# EAGLE design espseq (EAGLE 9.6.2)
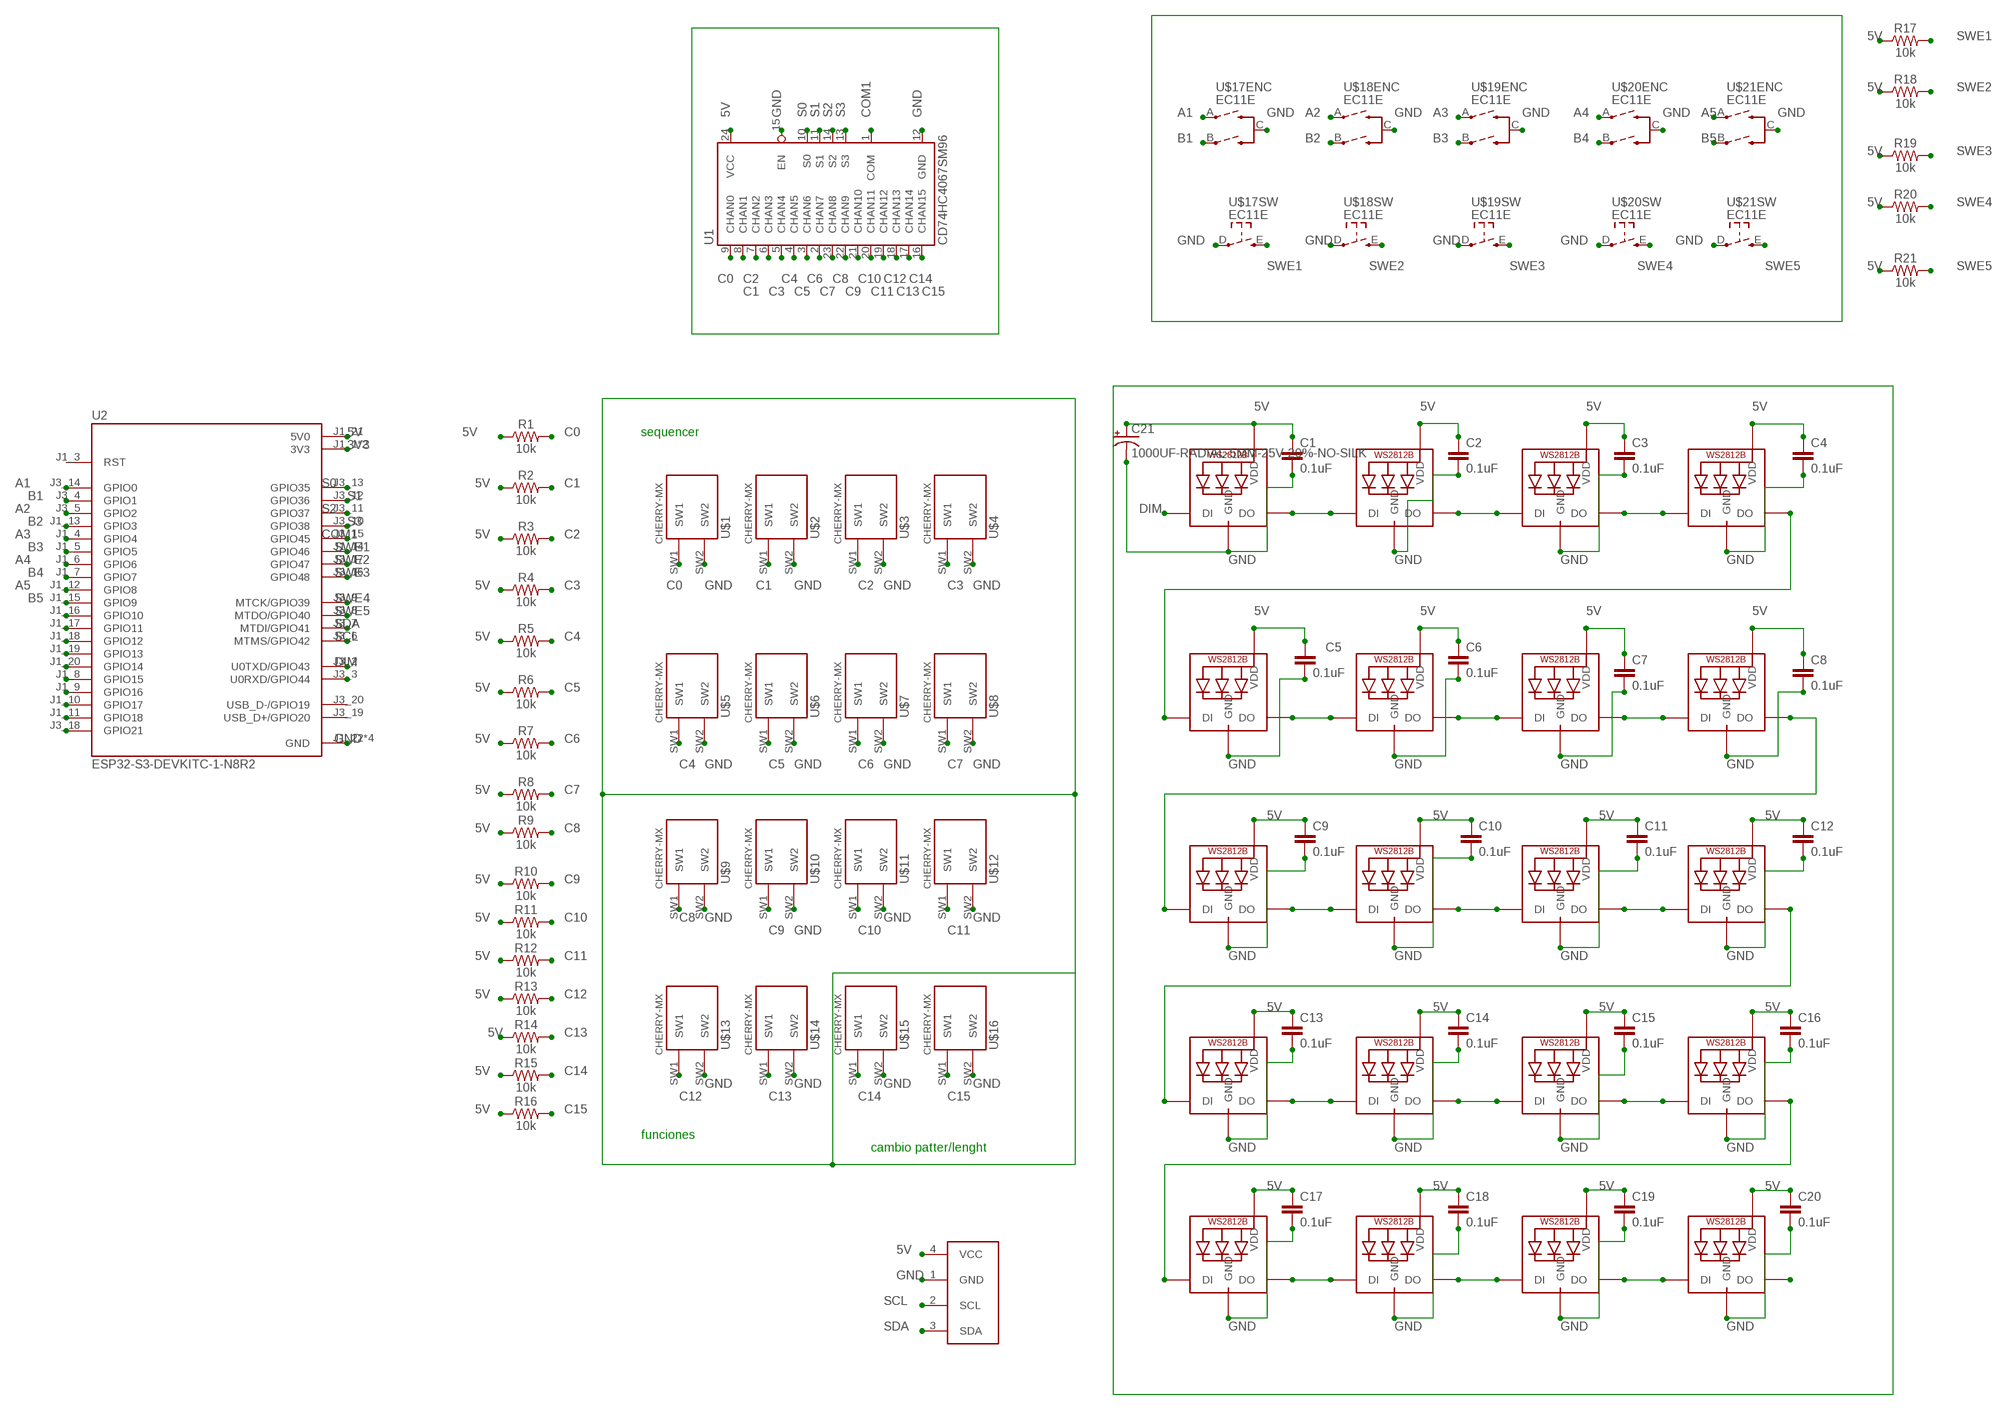
[diagram p0: schematic, sheet 1]

## Parts
C1  0.1uF  0.1UF-0402-6.3V-10%-X7R  [0402]
C2  0.1uF  0.1UF-0402-6.3V-10%-X7R  [0402]
C3  0.1uF  0.1UF-0402-6.3V-10%-X7R  [0402]
C4  0.1uF  0.1UF-0402-6.3V-10%-X7R  [0402]
C5  0.1uF  0.1UF-0402-6.3V-10%-X7R  [0402]
C6  0.1uF  0.1UF-0402-6.3V-10%-X7R  [0402]
C7  0.1uF  0.1UF-0402-6.3V-10%-X7R  [0402]
C8  0.1uF  0.1UF-0402-6.3V-10%-X7R  [0402]
C9  0.1uF  0.1UF-0402-6.3V-10%-X7R  [0402]
C10  0.1uF  0.1UF-0402-6.3V-10%-X7R  [0402]
C11  0.1uF  0.1UF-0402-6.3V-10%-X7R  [0402]
C12  0.1uF  0.1UF-0402-6.3V-10%-X7R  [0402]
C13  0.1uF  0.1UF-0402-6.3V-10%-X7R  [0402]
C14  0.1uF  0.1UF-0402-6.3V-10%-X7R  [0402]
C15  0.1uF  0.1UF-0402-6.3V-10%-X7R  [0402]
C16  0.1uF  0.1UF-0402-6.3V-10%-X7R  [0402]
C17  0.1uF  0.1UF-0402-6.3V-10%-X7R  [0402]
C18  0.1uF  0.1UF-0402-6.3V-10%-X7R  [0402]
C19  0.1uF  0.1UF-0402-6.3V-10%-X7R  [0402]
C20  0.1uF  0.1UF-0402-6.3V-10%-X7R  [0402]
C21  1000UF-RADIAL-5MM-25V-20%-NO-SILK  [CPOL-RADIAL-5MM-10MM-NS]
LED1  WS2812B5050  [WS2812B]
LED2  WS2812B5050  [WS2812B]
LED3  WS2812B5050  [WS2812B]
LED4  WS2812B5050  [WS2812B]
LED5  WS2812B5050  [WS2812B]
LED6  WS2812B5050  [WS2812B]
LED7  WS2812B5050  [WS2812B]
LED8  WS2812B5050  [WS2812B]
LED9  WS2812B5050  [WS2812B]
LED10  WS2812B5050  [WS2812B]
LED11  WS2812B5050  [WS2812B]
LED12  WS2812B5050  [WS2812B]
LED13  WS2812B5050  [WS2812B]
LED14  WS2812B5050  [WS2812B]
LED15  WS2812B5050  [WS2812B]
LED16  WS2812B5050  [WS2812B]
LED17  WS2812B5050  [WS2812B]
LED18  WS2812B5050  [WS2812B]
LED19  WS2812B5050  [WS2812B]
LED20  WS2812B5050  [WS2812B]
R1  10k  10KOHM-0402T-1/16W-1%  [0402-TIGHT]
R2  10k  10KOHM-0402T-1/16W-1%  [0402-TIGHT]
R3  10k  10KOHM-0402T-1/16W-1%  [0402-TIGHT]
R4  10k  10KOHM-0402T-1/16W-1%  [0402-TIGHT]
R5  10k  10KOHM-0402T-1/16W-1%  [0402-TIGHT]
R6  10k  10KOHM-0402T-1/16W-1%  [0402-TIGHT]
R7  10k  10KOHM-0402T-1/16W-1%  [0402-TIGHT]
R8  10k  10KOHM-0402T-1/16W-1%  [0402-TIGHT]
R9  10k  10KOHM-0402T-1/16W-1%  [0402-TIGHT]
R10  10k  10KOHM-0402T-1/16W-1%  [0402-TIGHT]
R11  10k  10KOHM-0402T-1/16W-1%  [0402-TIGHT]
R12  10k  10KOHM-0402T-1/16W-1%  [0402-TIGHT]
R13  10k  10KOHM-0402T-1/16W-1%  [0402-TIGHT]
R14  10k  10KOHM-0402T-1/16W-1%  [0402-TIGHT]
R15  10k  10KOHM-0402T-1/16W-1%  [0402-TIGHT]
R16  10k  10KOHM-0402T-1/16W-1%  [0402-TIGHT]
R17  10k  10KOHM-0402T-1/16W-1%  [0402-TIGHT]
R18  10k  10KOHM-0402T-1/16W-1%  [0402-TIGHT]
R19  10k  10KOHM-0402T-1/16W-1%  [0402-TIGHT]
R20  10k  10KOHM-0402T-1/16W-1%  [0402-TIGHT]
R21  10k  10KOHM-0402T-1/16W-1%  [0402-TIGHT]
U1  CD74HC4067SM96  74HC4067SM96  [SSOP24]
U2  ESP32-S3-DEVKITC-1-N8R2  [XCVR_ESP32-S3-DEVKITC-1-N8R2]
U$1  CHERRY-MXSTANDARD  [CHERRY-MX]
U$2  CHERRY-MXSTANDARD  [CHERRY-MX]
U$3  CHERRY-MXSTANDARD  [CHERRY-MX]
U$4  CHERRY-MXSTANDARD  [CHERRY-MX]
U$5  CHERRY-MXSTANDARD  [CHERRY-MX]
U$6  CHERRY-MXSTANDARD  [CHERRY-MX]
U$7  CHERRY-MXSTANDARD  [CHERRY-MX]
U$8  CHERRY-MXSTANDARD  [CHERRY-MX]
U$9  CHERRY-MXSTANDARD  [CHERRY-MX]
U$10  CHERRY-MXSTANDARD  [CHERRY-MX]
U$11  CHERRY-MXSTANDARD  [CHERRY-MX]
U$12  CHERRY-MXSTANDARD  [CHERRY-MX]
U$13  CHERRY-MXSTANDARD  [CHERRY-MX]
U$14  CHERRY-MXSTANDARD  [CHERRY-MX]
U$15  CHERRY-MXSTANDARD  [CHERRY-MX]
U$16  CHERRY-MXSTANDARD  [CHERRY-MX]
U$17  EC11E  [EC11E]
U$18  EC11E  [EC11E]
U$19  EC11E  [EC11E]
U$20  EC11E  [EC11E]
U$21  EC11E  [EC11E]
U$22  I2C_OLED  [I2C_OLED_PACKAGE]

## Nets
3V3: U2.J1_1(3V3) U2.J1_2(3V3)
5V: C1.1 C2.1 C3.1 C4.1 C5.1 C6.1 C7.1 C8.1 C9.1 C10.1 C11.1 C12.1 C13.1 C14.1 C15.1 C16.1 C17.1 C18.1 C19.1 C20.1 C21.+ LED1.1-VDD(VDD) LED2.1-VDD(VDD) LED3.1-VDD(VDD) LED4.1-VDD(VDD) LED5.1-VDD(VDD) LED6.1-VDD(VDD) LED7.1-VDD(VDD) LED8.1-VDD(VDD) LED9.1-VDD(VDD) LED10.1-VDD(VDD) LED11.1-VDD(VDD) LED12.1-VDD(VDD) LED13.1-VDD(VDD) LED14.1-VDD(VDD) LED15.1-VDD(VDD) LED16.1-VDD(VDD) LED17.1-VDD(VDD) LED18.1-VDD(VDD) LED19.1-VDD(VDD) LED20.1-VDD(VDD) R1.1 R2.1 R3.1 R4.1 R5.1 R6.1 R7.1 R8.1 R9.1 R10.1 R11.1 R12.1 R13.1 R14.1 R15.1 R16.1 R17.1 R18.1 R19.1 R20.1 R21.1 U1.24(VCC) U2.J1_21(5V0) U$22.4(VCC)
A1: U2.J3_14(GPIO0) U$17.A(ENC:A)
A2: U2.J3_5(GPIO2) U$18.A(ENC:A)
A3: U2.J1_4(GPIO4) U$19.A(ENC:A)
A4: U2.J1_6(GPIO6) U$20.A(ENC:A)
A5: U2.J1_12(GPIO8) U$21.A(ENC:A)
B1: U2.J3_4(GPIO1) U$17.B(ENC:B)
B2: U2.J1_13(GPIO3) U$18.B(ENC:B)
B3: U2.J1_5(GPIO5) U$19.B(ENC:B)
B4: U2.J1_7(GPIO7) U$20.B(ENC:B)
B5: U2.J1_15(GPIO9) U$21.B(ENC:B)
C0: R1.2 U1.9(CHAN0) U$1.SW1
C1: R2.2 U1.8(CHAN1) U$2.SW1
C2: R3.2 U1.7(CHAN2) U$3.SW1
C3: R4.2 U1.6(CHAN3) U$4.SW1
C4: R5.2 U1.5(CHAN4) U$5.SW1
C5: R6.2 U1.4(CHAN5) U$6.SW1
C6: R7.2 U1.3(CHAN6) U$7.SW1
C7: R8.2 U1.2(CHAN7) U$8.SW1
C8: R9.2 U1.23(CHAN8) U$9.SW1
C9: R10.2 U1.22(CHAN9) U$10.SW1
C10: R11.2 U1.21(CHAN10) U$11.SW1
C11: R12.2 U1.20(CHAN11) U$12.SW1
C12: R13.2 U1.19(CHAN12) U$13.SW1
C13: R14.2 U1.18(CHAN13) U$14.SW1
C14: R15.2 U1.17(CHAN14) U$15.SW1
C15: R16.2 U1.16(CHAN15) U$16.SW1
COM1: U1.1(COM) U2.J3_15(GPIO45)
DIM: LED1.4-DIN(DI) U2.J3_2(U0TXD/GPIO43)
GND: C1.2 C2.2 C3.2 C4.2 C5.2 C6.2 C7.2 C8.2 C9.2 C10.2 C11.2 C12.2 C13.2 C14.2 C15.2 C16.2 C17.2 C18.2 C19.2 C20.2 C21.- LED1.3-GND(GND) LED2.3-GND(GND) LED3.3-GND(GND) LED4.3-GND(GND) LED5.3-GND(GND) LED6.3-GND(GND) LED7.3-GND(GND) LED8.3-GND(GND) LED9.3-GND(GND) LED10.3-GND(GND) LED11.3-GND(GND) LED12.3-GND(GND) LED13.3-GND(GND) LED14.3-GND(GND) LED15.3-GND(GND) LED16.3-GND(GND) LED17.3-GND(GND) LED18.3-GND(GND) LED19.3-GND(GND) LED20.3-GND(GND) U1.12(GND) U1.15(EN) U2.J1_22(GND) U2.J3_1(GND) U2.J3_21(GND) U2.J3_22(GND) U$1.SW2 U$2.SW2 U$3.SW2 U$4.SW2 U$5.SW2 U$6.SW2 U$7.SW2 U$8.SW2 U$9.SW2 U$10.SW2 U$11.SW2 U$12.SW2 U$13.SW2 U$14.SW2 U$15.SW2 U$16.SW2 U$17.C(ENC:C) U$17.D U$18.C(ENC:C) U$18.D U$19.C(ENC:C) U$19.D U$20.C(ENC:C) U$20.D U$21.C(ENC:C) U$21.D U$22.1(GND)
N$3: LED1.2-DOUT(DO) LED2.4-DIN(DI)
N$7: LED2.2-DOUT(DO) LED3.4-DIN(DI)
N$11: LED3.2-DOUT(DO) LED4.4-DIN(DI)
N$16: LED4.2-DOUT(DO) LED5.4-DIN(DI)
N$19: LED5.2-DOUT(DO) LED6.4-DIN(DI)
N$21: U2.J1_16(GPIO10)
N$22: U2.J1_17(GPIO11)
N$23: LED6.2-DOUT(DO) LED7.4-DIN(DI)
N$24: U2.J1_18(GPIO12)
N$25: U2.J1_19(GPIO13)
N$26: U2.J1_20(GPIO14)
N$27: LED7.2-DOUT(DO) LED8.4-DIN(DI)
N$28: U2.J1_8(GPIO15)
N$29: U2.J1_9(GPIO16)
N$30: U2.J1_10(GPIO17)
N$31: U2.J1_11(GPIO18)
N$32: LED8.2-DOUT(DO) LED9.4-DIN(DI)
N$33: U2.J3_18(GPIO21)
N$35: LED9.2-DOUT(DO) LED10.4-DIN(DI)
N$39: LED10.2-DOUT(DO) LED11.4-DIN(DI)
N$43: LED11.2-DOUT(DO) LED12.4-DIN(DI)
N$48: LED12.2-DOUT(DO) LED13.4-DIN(DI)
N$51: LED13.2-DOUT(DO) LED14.4-DIN(DI)
N$52: U2.J3_3(U0RXD/GPIO44)
N$55: LED14.2-DOUT(DO) LED15.4-DIN(DI)
N$59: LED15.2-DOUT(DO) LED16.4-DIN(DI)
N$64: LED16.2-DOUT(DO) LED17.4-DIN(DI)
N$67: LED17.2-DOUT(DO) LED18.4-DIN(DI)
N$71: LED18.2-DOUT(DO) LED19.4-DIN(DI)
N$75: LED19.2-DOUT(DO) LED20.4-DIN(DI)
N$80: LED20.2-DOUT(DO)
S0: U1.10(S0) U2.J3_13(GPIO35)
S1: U1.11(S1) U2.J3_12(GPIO36)
S2: U1.14(S2) U2.J3_11(GPIO37)
S3: U1.13(S3) U2.J3_10(GPIO38)
SCL: U2.J3_6(MTMS/GPIO42) U$22.2(SCL)
SDA: U2.J3_7(MTDI/GPIO41) U$22.3(SDA)
SWE1: R17.2 U2.J1_14(GPIO46) U$17.E
SWE2: R18.2 U2.J3_17(GPIO47) U$18.E
SWE3: R19.2 U2.J3_16(GPIO48) U$19.E
SWE4: R20.2 U2.J3_9(MTCK/GPIO39) U$20.E
SWE5: R21.2 U2.J3_8(MTDO/GPIO40) U$21.E
Unconnected: U2.J1_3(RST) U2.J3_19(USB_D+/GPIO20) U2.J3_20(USB_D-/GPIO19)

## Notes on the sheet
- sequencer
- funciones
- cambio patter/lenght

## Library data of the parts
C1-C20 = SparkFun-Capacitors:0.1UF: 0.1µF ceramic capacitors A capacitor is a passive two-terminal electrical component used to store electrical energy temporarily in an electric field.; PROD_ID: CAP-14993
C21 = SparkFun-Capacitors:1000UF: 1,000µF/1mF ceramic capacitors A capacitor is a passive two-terminal electrical component used to store electrical energy temporarily in an electric field. CAP-08070
LED1-LED20 = adafruit:WS2812B
R1-R21 = SparkFun-Resistors:10KOHM: 10kΩ resistor A resistor is a passive two-terminal electrical component that implements electrical resistance as a circuit element. Resistors act to reduce current flow, and, at the same time, act to lower voltage levels within circuits. - Wikipedia; PROD_ID: RES-14241
U1 = SparkFun-IC-Logic:74*4067: 16-channel analog MUX Datasheet <http://www.sparkfun.com/datasheets/IC/cd74hc4067.pdf> SparkFun Products MP3 Trigger <https://www.sparkfun.com/products/13720> (WIG-13720) SparkFun Analog/Digital MUX Breakout - CD74HC4067 <https://www.sparkfun.com/products/9056> (BOB-09056); PROD_ID: IC-08252
U2 = ESP32-S3-DEVKITC-1-N8R2:ESP32-S3-DEVKITC-1-N8R2: Check availability <https://pricing.snapeda.com/parts/ESP32-S3-DEVKITC-1-N8R2/Espressif%20Systems/view-part?ref=eda>; AVAILABILITY: In Stock; CHECK_PRICES: https://www.snapeda.com/parts/ESP32-S3-DEVKITC-1-N8R2/Espressif+Systems/view-part/?ref=eda; DESCRIPTION: WiFi Development Tools - 802.11 ESP32-S3 general-purpose development board, embeds ESP32-S3-WROOM-1-N8R2, with pin header; MF: Espressif Systems; MP: ESP32-S3-DEVKITC-1-N8R2; PACKAGE: None; PRICE: None; SNAPEDA_LINK: https://www.snapeda.com/parts/ESP32-S3-DEVKITC-1-N8R2/Espressif+Systems/view-part/?ref=snap
U$1-U$16 = cherrymx:CHERRY-MX: Cherry MX series keyswitch
U$17-U$21 = logick:EC11
U$22 = DIYMall_OLED:I2C_OLED

## Board
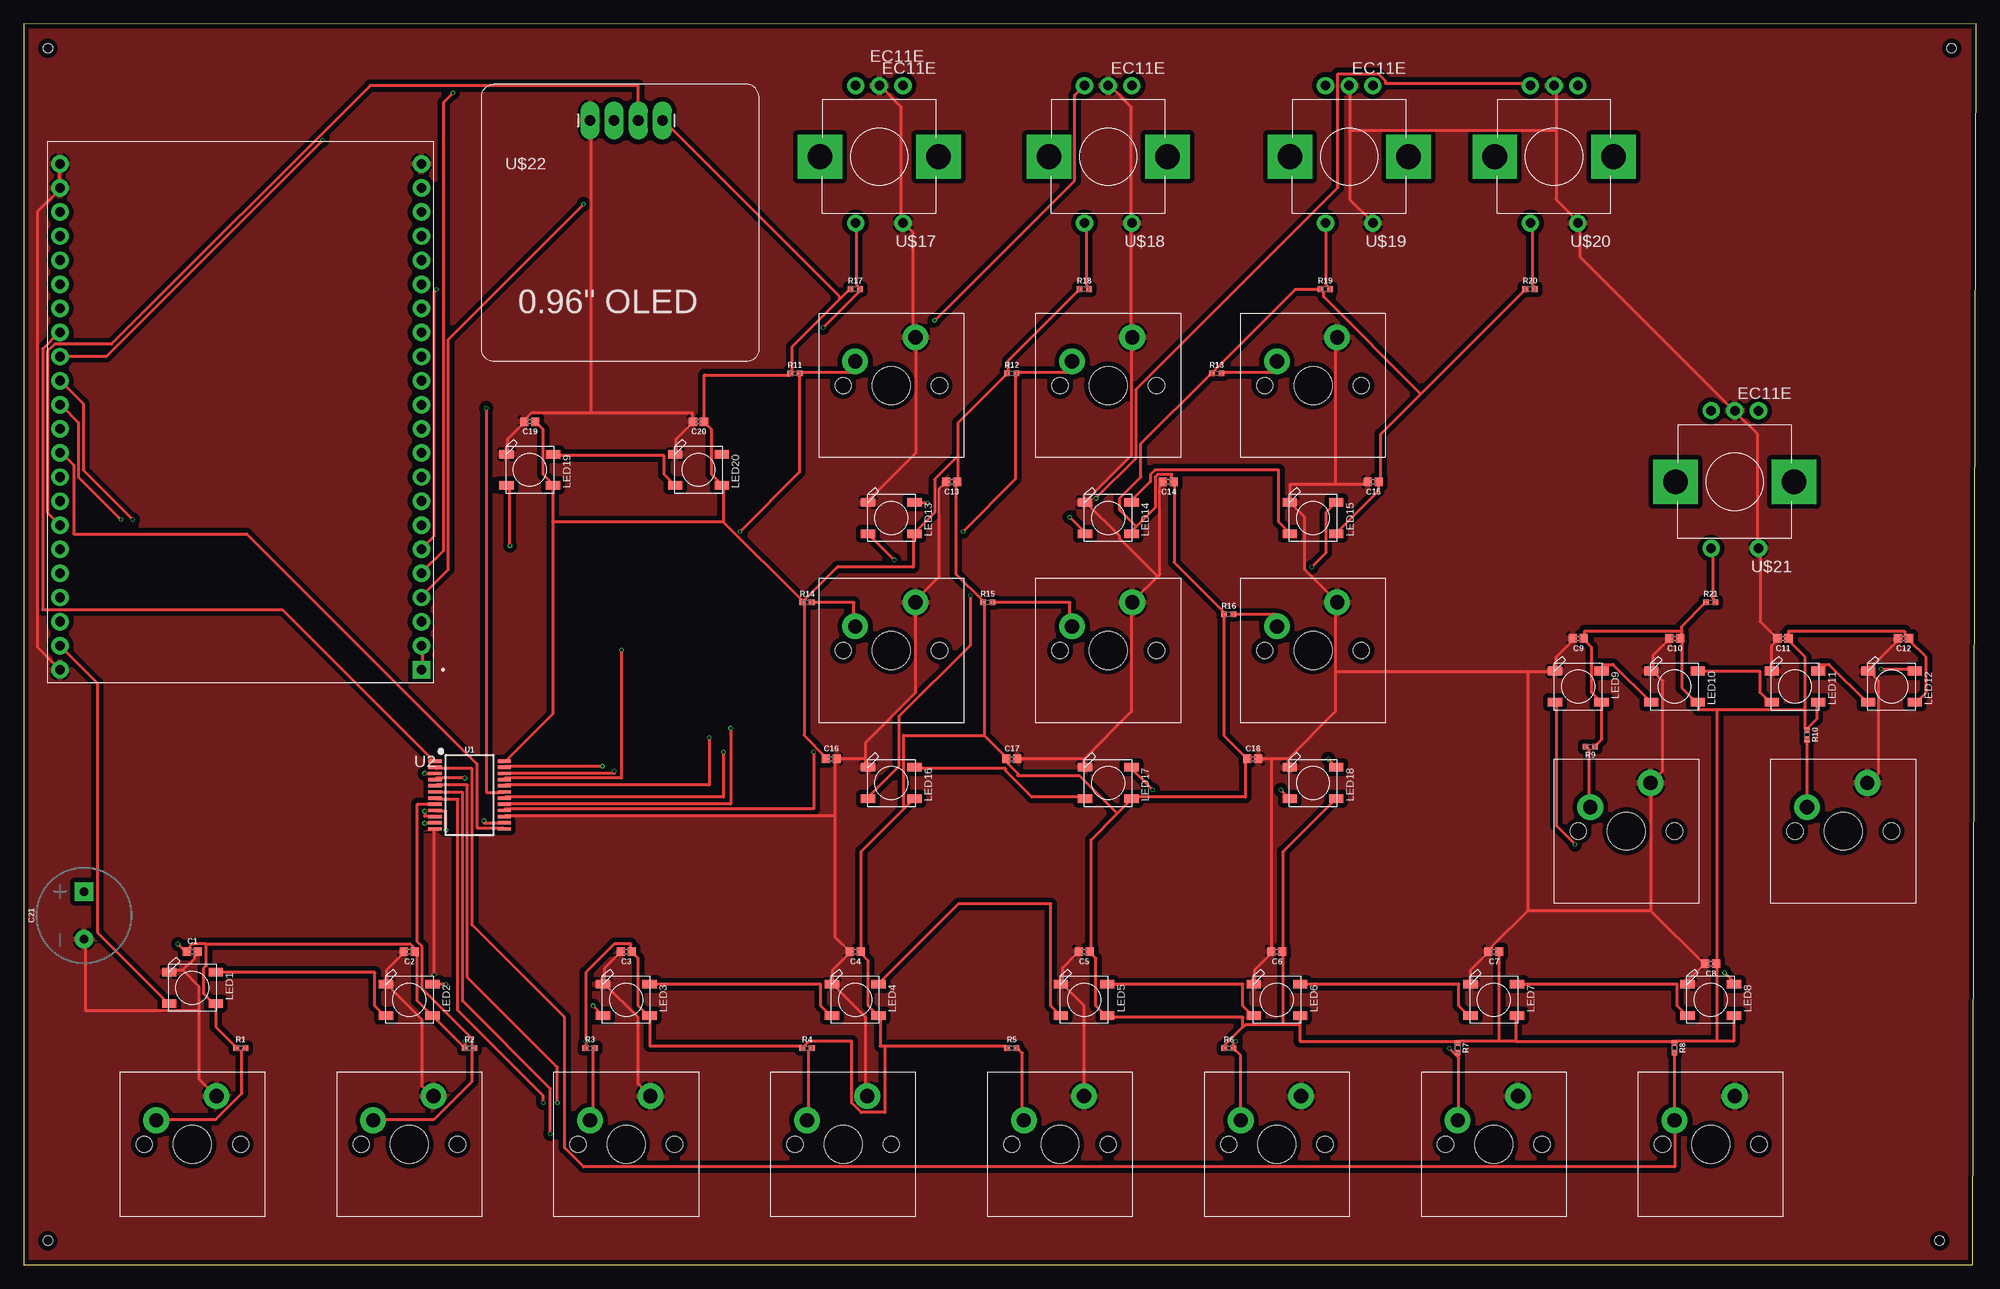
[diagram p1: board, top side]
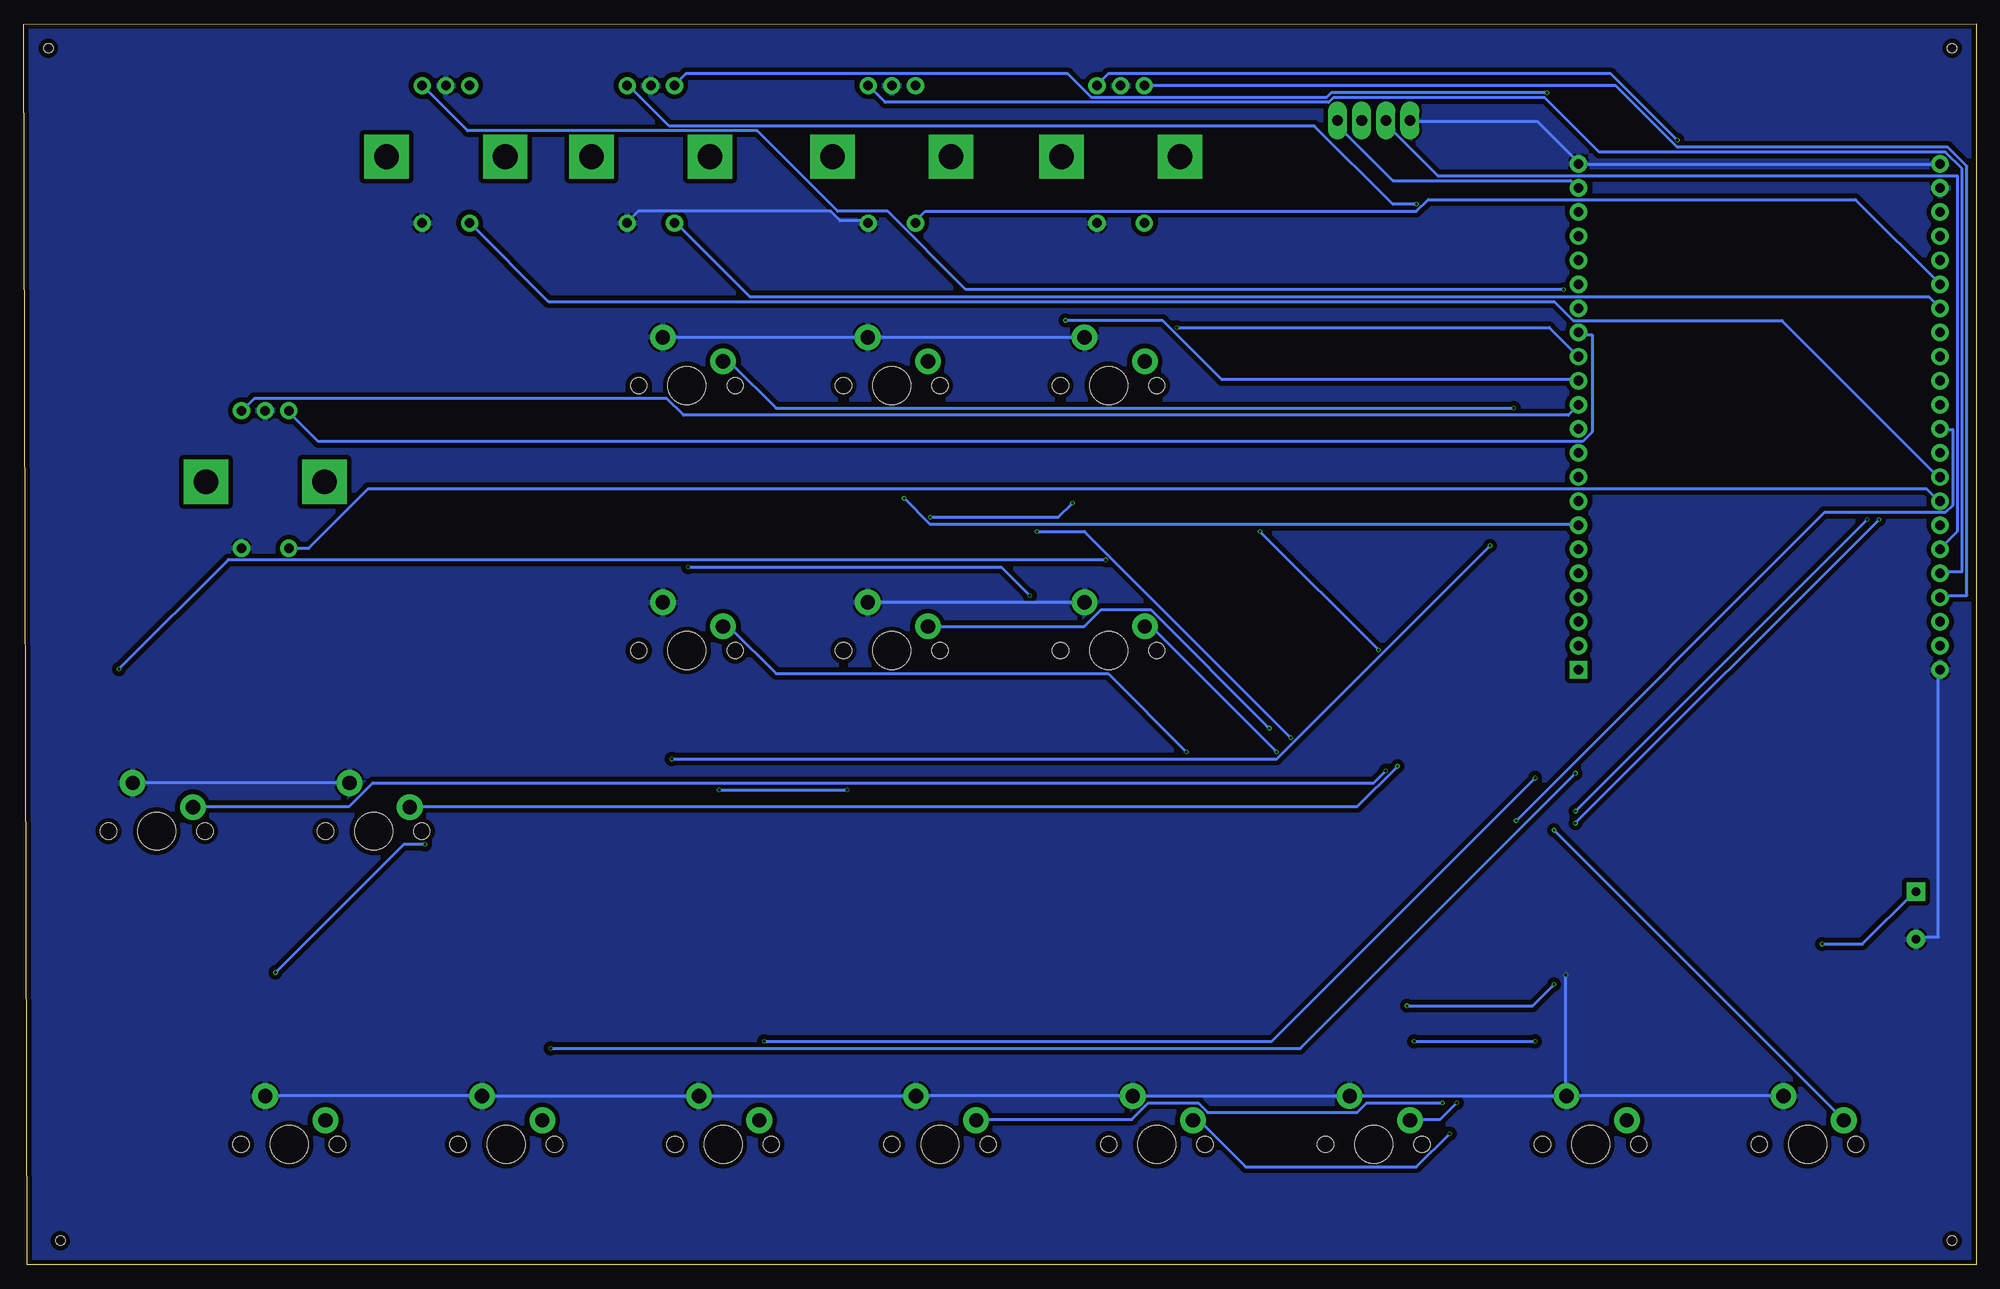
[diagram p2: board, bottom side, seen from below]

Size 205.79 x 130.86 mm. Coordinates in mm from the lower left corner, seen from the top.
Outline: 0,0 205.41,0 205.79,130.8 0,130.86 0,0
Copper layers (1*16): Top 0.035mm / dielectric 1.6mm / Bottom 0.035mm
Design rules "jlcpcb-2layers *": minimum track width 12mil, minimum drill 0.3mm, track to track 5mil, track to pad 5mil, pad to pad 5mil, via to via 5mil, smd to smd 5mil, copper to edge 0.2mm, drill to drill 6mil, minimum pad ring 10mil, minimum via ring 3mil, stop-mask expansion 4mil, vias tented up to drill 0mil, thermal gap 10mil
Holes 1 mm at 2.54,2.54 201.93,2.54 2.54,128.27 203.2,128.27

### Footprints (pad centres in the part's own frame; a part is rotated, then mirrored left to right if it is on the bottom)
0402 = smd 0.85 x 0.9: 1 -0.58,0; 2 0.58,0
CPOL-RADIAL-5MM-10MM-NS = drill 0.9 pad 1.93 square: + 2.5,0 | drill 0.9 pad 1.93: - -2.5,0
WS2812B = smd 1.5 x 0.9: 1-VDD 2.45,-1.65; 2-DOUT 2.45,1.65; 3-GND -2.45,1.65; 4-DIN -2.45,-1.65
0402-TIGHT = smd 0.6 x 0.6: 1 -0.5,0; 2 0.5,0
SSOP24 = smd 0.348 x 1.397: 1 -3.575,-3.656; 2 -2.925,-3.656; 3 -2.275,-3.656; 4 -1.625,-3.656; 5 -0.975,-3.656; 6 -0.325,-3.656; 7 0.325,-3.656; 8 0.975,-3.656; 9 1.625,-3.656; 10 2.275,-3.656; 11 2.925,-3.656; 12 3.575,-3.656; 13 3.575,3.656; 14 2.925,3.656; 15 2.275,3.656; 16 1.625,3.656; 17 0.975,3.656; 18 0.325,3.656; 19 -0.325,3.656; 20 -0.975,3.656; 21 -1.625,3.656; 22 -2.275,3.656; 23 -2.925,3.656; 24 -3.575,3.656
XCVR_ESP32-S3-DEVKITC-1-N8R2 = drill 1.02 square: J1_1 -11.43,29.97 | drill 1.02: J1_2 -11.43,27.43; J1_3 -11.43,24.89; J1_4 -11.43,22.35; J1_5 -11.43,19.81; J1_6 -11.43,17.27; J1_7 -11.43,14.73; J1_8 -11.43,12.19; J1_9 -11.43,9.65; J1_10 -11.43,7.11; J1_11 -11.43,4.57; J1_12 -11.43,2.03; J1_13 -11.43,-0.51; J1_14 -11.43,-3.05; J1_15 -11.43,-5.59; J1_16 -11.43,-8.13; J1_17 -11.43,-10.67; J1_18 -11.43,-13.21; J1_19 -11.43,-15.75; J1_20 -11.43,-18.29; J1_21 -11.43,-20.83; J1_22 -11.43,-23.37; J3_1 26.67,29.97; J3_2 26.67,27.43; J3_3 26.67,24.89; J3_4 26.67,22.35; J3_5 26.67,19.81; J3_6 26.67,17.27; J3_7 26.67,14.73; J3_8 26.67,12.19; J3_9 26.67,9.65; J3_10 26.67,7.11; J3_11 26.67,4.57; J3_12 26.67,2.03; J3_13 26.67,-0.51; J3_14 26.67,-3.05; J3_15 26.67,-5.59; J3_16 26.67,-8.13; J3_17 26.67,-10.67; J3_18 26.67,-13.21; J3_19 26.67,-15.75; J3_20 26.67,-18.29; J3_21 26.67,-20.83; J3_22 26.67,-23.37
CHERRY-MX = drill 1.5 pad 2.54: SW1 -3.81,2.54; SW2 2.54,5.08 | hole 4: 0,0 | hole 1.714: 5.08,0; -5.08,0
EC11E = drill 1: A -2.5,-7.5; B 2.5,-7.5; C 0,-7.5; D -2.5,7; E 2.5,7 | drill 2.6 square: P$6 -6.25,0; P$7 6.25,0
I2C_OLED_PACKAGE = drill 1.118 pad 1.88 long: 1 0,0; 2 2.54,0; 3 5.08,0; 4 7.62,0

### Placement (x,y rotation side)
C1  17.78,33.02 0 top
C2  40.64,33.02 180 top
C3  63.5,33.02 180 top
C4  87.63,33.02 180 top
C5  111.76,33.02 180 top
C6  132.08,33.02 180 top
C7  154.94,33.02 180 top
C8  177.8,31.75 180 top
C9  163.83,66.04 180 top
C10  173.99,66.04 180 top
C11  185.42,66.04 180 top
C12  198.12,66.04 180 top
C13  97.79,82.55 180 top
C14  120.65,82.55 180 top
C15  142.24,82.55 180 top
C16  85.09,53.34 0 top
C17  104.14,53.34 0 top
C18  129.54,53.34 0 top
C19  53.34,88.9 180 top
C20  71.12,88.9 180 top
C21  6.35,36.83 90 top
LED1  17.78,29.21 0 top
LED2  40.64,27.94 0 top
LED3  63.5,27.94 0 top
LED4  87.63,27.94 0 top
LED5  111.76,27.94 0 top
LED6  132.08,27.94 0 top
LED7  154.94,27.94 0 top
LED8  177.8,27.94 0 top
LED9  163.83,60.96 0 top
LED10  173.99,60.96 0 top
LED11  186.69,60.96 0 top
LED12  196.85,60.96 0 top
LED13  91.44,78.74 0 top
LED14  114.3,78.74 0 top
LED15  135.89,78.74 0 top
LED16  91.44,50.8 0 top
LED17  114.3,50.8 0 top
LED18  135.89,50.8 0 top
LED19  53.34,83.82 0 top
LED20  71.12,83.82 0 top
R1  22.86,22.86 0 top
R2  46.99,22.86 0 top
R3  59.69,22.86 0 top
R4  82.55,22.86 0 top
R5  104.14,22.86 0 top
R6  127,22.86 0 top
R7  151.13,22.86 270 top
R8  173.99,22.86 270 top
R9  165.1,54.61 180 top
R10  187.96,55.88 270 top
R11  81.28,93.98 0 top
R12  104.14,93.98 0 top
R13  125.73,93.98 0 top
R14  82.55,69.85 0 top
R15  101.6,69.85 0 top
R16  127,68.58 0 top
R17  87.63,102.87 0 top
R18  111.76,102.87 0 top
R19  137.16,102.87 0 top
R20  158.75,102.87 0 top
R21  177.8,69.85 0 top
U1  46.99,49.53 270 top
U2  30.48,92.71 180 top
U$1  17.78,12.7 0 top
U$2  40.64,12.7 0 top
U$3  63.5,12.7 0 top
U$4  86.36,12.7 0 top
U$5  109.22,12.7 0 top
U$6  132.08,12.7 0 top
U$7  154.94,12.7 0 top
U$8  177.8,12.7 0 top
U$9  168.91,45.72 0 top
U$10  191.77,45.72 0 top
U$11  91.44,92.71 0 top
U$12  114.3,92.71 0 top
U$13  135.89,92.71 0 top
U$14  91.44,64.77 0 top
U$15  114.3,64.77 0 top
U$16  135.89,64.77 0 top
U$17  90.17,116.84 180 top
U$18  114.3,116.84 180 top
U$19  139.7,116.84 180 top
U$20  161.29,116.84 180 top
U$21  180.34,82.55 180 top
U$22  59.69,120.65 0 top

### Tracks (layer width: path | path; a pad name or v marks a point on that pad's centre or on a via)
3V3
  Top 0.305: U2.J1_1 42,62.82 42,65.07 U2.J1_2
5V  (via drill 0.3)
  Top 0.305: 147.25,91.82 143,87.57 143,82.57 C15.1 142.75,82.32 142.75,81.57 138.5,77.32 LED15.1-VDD | 147.25,91.82 158.25,102.82 R20.1 | 147.25,91.82 137,102.07 137,102.57 136.75,102.82 R19.1 136.5,102.82 134,102.82 125.25,94.07 R13.1 125,93.82 117.75,86.57 117.75,83.07 115.5,80.82 115.5,79.57 117.25,77.82 | LED12.1-VDD 199.5,59.32 200.5,60.32 200.5,64.07 198.75,65.82 C12.1 198.5,66.07 198.25,66.32 198.25,66.82 186,66.82 C11.1 186,65.82 187.75,64.07 187.75,58.57 | LED11.1-VDD 189,59.07 189,57.57 188,56.57 R10.1 187.75,56.57 187.75,58.57 | 174.75,66.82 174.75,66.07 C10.1 174.75,65.82 174.75,60.82 176.25,59.32 LED10.1-VDD 176.5,59.07 176.5,58.57 178.5,58.57 | 174.75,66.82 174.75,67.32 177.25,69.82 R21.1 | R9.1 165.75,54.82 166.25,55.32 166.25,59.07 LED9.1-VDD 166.25,59.32 165.25,60.32 165.25,65.07 164.5,65.82 C9.1 164.5,66.07 164.5,66.82 174.75,66.82 | 178.5,58.57 187.75,58.57 | 117.25,77.82 119.25,79.82 119.25,83.07 119.5,83.32 121,83.32 121,82.57 C14.1 121.25,82.32 121.25,74.07 126.5,68.82 R16.1 126.5,55.82 128.75,53.57 C18.1 128.75,53.32 128.75,49.32 116.75,49.32 LED17.1-VDD 116.75,49.07 115.25,47.57 | 117.25,77.82 116.75,77.32 LED14.1-VDD | 178.5,23.57 180.25,23.57 LED8.1-VDD | 178.5,23.57 174,23.57 R8.1 173.75,23.57 157.25,23.57 | 178.5,23.57 178.5,31.57 C8.1 178.5,31.82 178.5,58.57 | 157.25,23.57 155.5,23.57 | 155.5,23.57 151.25,23.57 R7.1 151,23.57 134.5,23.57 134.5,25.32 | 157.25,23.57 157.25,26.07 LED7.1-VDD | 155.5,23.57 155.5,32.82 C7.1 | 128.5,25.07 128.75,25.32 132.75,25.32 | 128.5,25.07 126.5,23.07 R6.1 | 134.5,25.32 132.75,25.32 | 134.5,25.32 134.5,26.07 LED6.1-VDD
  Top 0.305: 132.75,25.32 132.75,32.82 C6.1 132.75,33.07 132.75,43.57 138.25,49.07 LED18.1-VDD | 128.5,25.07 128.5,26.07 114.25,26.07 LED5.1-VDD 114,26.32 113,27.32 113,32.32 112.5,32.82 C5.1 112.5,33.07 112.5,44.82 115.25,47.57 | C19.1 54.75,88.07 54.75,83.32 55.75,82.32 LED19.1-VDD 55.75,82.07 55.75,78.32 | 55.75,78.32 55.75,58.07 50.75,53.07 U1.24 | 86,101.82 81,96.82 81,94.07 R11.1 80.75,93.82 71.75,93.82 71.75,89.07 C20.1 71.75,88.82 72.5,88.07 72.5,83.32 73.5,82.32 LED20.1-VDD 73.75,82.07 73.75,78.32 | 86,101.82 87,102.82 R17.1 | 73.75,78.32 82,70.07 R14.1 | C16.1 84.5,53.57 82.25,55.82 82.25,69.82 R14.1 | 86,101.82 86,102.07 67.5,120.57 U$22.4 | 73.75,78.32 55.75,78.32 | 98.5,85.32 98.5,82.57 C13.1 98.25,82.32 98.25,72.82 101,70.07 R15.1 101.25,69.82 101.25,55.82 | 98.5,85.32 98.5,88.82 103.5,93.82 R12.1 103.75,94.07 103.75,95.32 111.25,102.82 R18.1 | 101.25,55.82 103.5,53.57 C17.1 103.75,53.32 103.75,52.82 104.75,51.82 104.75,51.57 111.25,51.57 115.25,47.57 | 98.5,85.32 96,82.82 96,79.32 94,77.32 LED13.1-VDD 93.75,77.07 93.75,73.57 85.75,73.57 82.25,70.07 R14.1 | R1.1 22.25,23.07 20.25,25.07 20.25,27.32 LED1.1-VDD 20,27.57 19,28.57 19,31.32 19.25,31.57 19.25,33.82 | 19.25,33.82 17.75,33.82 17.5,33.57 17.5,33.32 C1.1 17,33.07 v16.25,33.82 | 19.25,33.82 40.75,33.82 41,33.57 41,33.07 C2.1 41.25,32.82 41.5,32.57 41.5,27.82 43,26.32 LED2.1-VDD 43.25,26.07 46.25,23.07 R2.1 46.5,23.07 v46.5,23.57 | R3.1 59.25,23.07 v59.25,23.57 59.25,30.82 62.25,33.82 64,33.82 64,33.07 C3.1 64.25,32.82 64.75,32.32 64.75,27.32 65.75,26.32 LED3.1-VDD 66,26.07 66,23.07 82,23.07 R4.1 82.25,23.07 82.75,23.57 87.25,23.57 87.25,17.07 88.25,16.07 90.75,16.07 90.75,23.07
  Top 0.305: 90.75,23.07 90.25,23.07 90.25,26.07 LED4.1-VDD 90,26.32 89,27.32 89,32.07 88.25,32.82 C4.1 88.25,33.07 88.25,43.57 92.75,48.07 | 90.75,23.07 103.5,23.07 R5.1 | 92.75,48.07 93.75,49.07 LED16.1-VDD | 101.25,55.82 92.75,55.82 92.75,48.07
  Bottom 0.305: U2.J1_21 42,113.57 42.75,114.32 61.5,114.32 67.25,120.07 67.25,120.57 U$22.4 | v16.25,33.82 12,33.82 6.5,39.32 C21.+ | v59.25,23.57 v46.5,23.57
A1  (via drill 0.3)
  Top 0.305: v31.5,118.57 8.75,95.82 4,95.82 U2.J3_14
  Bottom 0.305: v31.5,118.57 38.5,125.57 91.5,125.57 92.5,124.57 U$17.A
A2
  Bottom 0.305: U$18.A 116.75,124.32 115,122.57 68.25,122.57 67.75,123.07 45.5,123.07 39.75,117.32 3.25,117.32 1.5,115.57 1.5,73.07 3.75,73.07 U2.J3_5
A3  (via drill 0.3)
  Top 0.305: v59,111.82 44.75,97.57 44.75,73.32 42,70.57 U2.J1_4
  Bottom 0.305: v59,111.82 61.5,111.82 69.75,120.07 137.75,120.07 142,124.32 U$19.A
A4  (via drill 0.3)
  Top 0.305: v43.5,102.82 43.25,102.57 43.25,76.82 42,75.57 U2.J1_6
  Bottom 0.305: v43.5,102.82 106.5,102.82 114.75,111.07 120,111.07 128.5,119.57 159,119.57 163.75,124.32 U$20.A
A5
  Bottom 0.305: U$21.A 182.75,90.07 181.5,91.32 138,91.32 136.25,89.57 43,89.57 42,90.57 U2.J1_12
B1
  Bottom 0.305: U$17.B 87.5,124.32 38,124.32 31.5,117.82 3,117.82 1,115.82 1,70.57 3.75,70.57 U2.J3_4
B2  (via drill 0.3)
  Top 0.305: v96,99.57 110.75,114.32 110.75,123.32 111.75,124.32 U$18.B
  Bottom 0.305: v96,99.57 85.75,99.57 79.5,93.32 42,93.32 U2.J1_13
B3  (via drill 0.3)
  Top 0.305: v45.25,123.57 44.25,122.57 44.25,75.32 42,73.07 U2.J1_5
  Bottom 0.305: v45.25,123.57 68,123.57 68.5,123.07 93.25,123.07 95.75,125.57 136,125.57 137,124.57 U$19.B
B4  (via drill 0.3)
  Top 0.305: v113,80.82 117.25,85.07 117.25,92.32 138.5,113.57 138.5,125.57 142.75,125.57 143.5,124.82 143.5,124.57 158.75,124.57 U$20.B
  Bottom 0.305: v113,80.82 110.25,78.07 42,78.07 U2.J1_7
B5
  Bottom 0.305: U$21.B 177.75,89.82 174.75,86.82 41.5,86.82 40.5,87.82 40.5,98.07 41.75,98.07 U2.J1_15
C0  (via drill 0.3)
  Top 0.305: R1.2 23.25,22.82 23,22.57 23,18.07 20.25,15.32 14,15.32 U$1.SW1 | v44.5,45.82 44.5,47.82 43.5,47.82 U1.9
  Bottom 0.305: v44.5,45.82 14,15.32 U$1.SW1
C1
  Top 0.305: U$2.SW1 37,15.32 43.25,15.32 47.25,19.32 47.25,22.82 R2.2 47.25,23.07 47.25,23.82 42,29.07 42,33.57 41.5,34.07 41.5,48.57 43.25,48.57 U1.8
C2  (via drill 0.3)
  Top 0.305: R3.2 60,22.82 60,15.57 59.75,15.32 U$3.SW1 | v54.75,17.07 54.75,17.82 45.75,26.82 45.75,49.07 43.5,49.07 U1.7
  Bottom 0.305: v54.75,17.07 56.5,15.32 59.5,15.32 U$3.SW1
C3  (via drill 0.3)
  Top 0.305: R4.2 83,22.82 82.75,22.57 82.75,15.32 U$4.SW1 | v55.5,13.82 55.5,18.57 46.25,27.82 46.25,49.82 43.5,49.82 U1.6
  Bottom 0.305: v55.5,13.82 59,10.32 77,10.32 81.75,15.07 82.5,15.07 U$4.SW1
C4  (via drill 0.3)
  Top 0.305: R5.2 104.75,22.82 105.25,22.32 105.25,15.32 U$5.SW1 | v56.25,17.07 56.25,20.82 46.75,30.32 46.75,50.57 43.5,50.57 U1.5
  Bottom 0.305: v56.25,17.07 64.25,17.07 65.25,16.07 81,16.07 82,17.07 87.25,17.07 89,15.32 105.25,15.32 U$5.SW1
C5  (via drill 0.3)
  Top 0.305: U$6.SW1 128.25,15.32 128.25,22.07 127.5,22.82 R6.2 127.5,23.32 v127.75,23.57 | v46.5,51.32 43.5,51.32 U1.4
  Bottom 0.305: v46.5,51.32 74.25,23.57 v127.75,23.57
C6  (via drill 0.3)
  Top 0.305: 151.25,21.82 151.25,15.32 U$7.SW1 | 151.25,21.82 151.25,22.32 R7.2 | v42.25,51.82 43.25,51.82 U1.3 | 151.25,21.82 v150.25,22.82
  Bottom 0.305: v42.25,51.82 71.25,22.82 v150.25,22.82
C7
  Top 0.305: R8.2 174,22.32 174,15.32 U$8.SW1 174,15.07 174,10.32 59,10.32 57,12.32 57,26.07 47.25,35.82 47.25,52.32 43.5,52.32 U1.2
C8  (via drill 0.3)
  Top 0.305: R9.2 164.75,54.57 165,54.32 165,48.32 U$9.SW1 | v61,52.57 50.75,52.57 U1.23
  Bottom 0.305: v61,52.57 65.25,48.32 165,48.32 U$9.SW1
C9  (via drill 0.3)
  Top 0.305: R10.2 188,55.32 188,48.32 U$10.SW1 | v62.25,52.07 62.25,51.82 50.75,51.82 U1.22
  Bottom 0.305: v62.25,52.07 63.5,50.82 169,50.82 171.5,48.32 187.75,48.32 U$10.SW1
C10  (via drill 0.3)
  Top 0.305: U$11.SW1 87.5,95.07 87.5,94.07 82,94.07 R11.2 81.75,93.82 81.75,83.57 v75.5,77.32 | v63,64.82 63,51.32 50.75,51.32 U1.21
  Bottom 0.305: v75.5,77.32 v63,64.82
C11  (via drill 0.3)
  Top 0.305: U$12.SW1 110.25,95.07 110.25,94.07 104.75,94.07 R12.2 104.5,93.82 104.5,82.82 v99,77.32 | v72.25,55.57 72.25,50.57 50.75,50.57 U1.20
  Bottom 0.305: v72.25,55.57 94,77.32 v99,77.32
C12  (via drill 0.3)
  Top 0.305: R13.2 126.25,94.07 132,94.07 132,95.07 U$13.SW1 | v48.75,90.32 48.75,49.82 50.5,49.82 U1.19
  Bottom 0.305: v48.75,90.32 126.5,90.32 131.25,95.07 132,95.07 U$13.SW1
C13  (via drill 0.3)
  Top 0.305: R14.2 83.25,69.82 87.5,69.82 87.5,67.32 U$14.SW1 | v73.75,54.07 73.75,49.32 50.75,49.32 U1.18
  Bottom 0.305: v73.75,54.07 86.75,67.07 87.5,67.07 U$14.SW1
C14  (via drill 0.3)
  Top 0.305: R15.2 102.25,69.82 110.25,69.82 110.25,67.32 U$15.SW1 | v74.5,56.57 74.5,48.57 50.75,48.57 U1.17
  Bottom 0.305: v74.5,56.57 87,69.07 92.25,69.07 94,67.32 110.25,67.32 U$15.SW1
C15  (via drill 0.3)
  Top 0.305: R16.2 132,68.57 132,67.32 U$16.SW1 | v83.25,54.07 83.25,48.07 50.75,48.07 U1.16
  Bottom 0.305: v83.25,54.07 91.5,62.32 126.5,62.32 131.25,67.07 132,67.07 U$16.SW1
COM1
  Top 0.305: U1.1 43.25,53.07 27.25,69.07 2,69.07 2,96.57 3.75,98.32 U2.J3_15
DIM
  Top 0.305: LED1.4-DIN 15.25,27.57 7.75,35.07 7.75,61.32 4,65.07 U2.J3_2
GND  (via drill 0.3)
  Top 0.305: LED11.3-GND 184.25,62.82 184.25,65.32 184.75,65.82 C11.2 184.75,66.07 183,67.82 183,75.32 U$21.D 182.75,75.57 182.75,87.57 180.5,89.82 U$21.C 180.25,90.07 164,106.32 164,109.82 U$20.D 163.75,110.07 161.5,112.32 161.5,119.57 | 139.75,119.57 139.75,124.32 U$19.C | 139.75,119.57 139.75,112.32 142,110.07 U$19.D | 161.5,119.57 161.5,124.32 U$20.C | 161.5,119.57 139.75,119.57 | C12.2 197.5,65.82 194.5,62.82 LED12.3-GND 194.5,62.57 195.5,61.57 195.5,51.82 194.5,50.82 U$10.SW2 | C10.2 173.25,65.82 171.75,64.32 171.75,62.82 LED10.3-GND 171.75,62.57 172.75,61.57 172.75,52.07 171.5,50.82 U$9.SW2 171.5,50.57 171.5,37.32 | LED7.3-GND 152.5,29.82 152.5,31.07 154.25,32.82 C7.2 154.5,33.07 154.75,33.32 154.75,33.57 158.5,37.32 | LED8.3-GND 175.5,29.82 175.5,30.07 177,31.57 C8.2 177,31.82 171.5,37.32 | 171.5,37.32 158.5,37.32 | LED13.3-GND 89,80.57 94,85.57 94,97.57 U$11.SW2 93.75,97.82 93.75,108.82 92.75,109.82 U$17.D 92.5,110.07 92.5,122.07 90.25,124.32 U$17.C | 111.75,53.32 104.75,53.32 C17.2 | 111.75,53.32 111.75,52.57 LED17.3-GND | 119.5,72.57 117,70.07 U$15.SW2 116.75,69.82 116.75,58.32 111.75,53.32 | 119.5,72.57 119.75,72.82 119.75,82.07 120,82.32 C14.2 | 119.5,72.57 115.5,76.57 115.5,76.82 112,80.32 LED14.3-GND 112,80.57 116.75,85.32 116.75,97.57 U$12.SW2 116.75,97.82 116.75,109.82 U$18.D 116.75,110.07 116.75,122.07 114.5,124.32 U$18.C | 138.25,82.32 133.5,82.32 133.5,80.57 LED15.3-GND 133.5,80.32 135,78.82 135,73.32 138.25,70.07 U$16.SW2 138.25,69.82 138.25,62.57 | 138.25,82.32 141.5,82.32 C15.2 | 138.25,82.32 138.25,97.57 U$13.SW2 | C9.2 163.25,65.82 161.5,64.07 161.5,62.82 LED9.3-GND 161.25,62.57 158.5,62.57
  Top 0.305: LED6.3-GND 129.75,29.82 129.75,31.07 131.5,32.82 C6.2 131.5,53.32 | 133.25,53.32 131.5,53.32 | 131.5,53.32 130.25,53.32 C18.2 | 133.25,53.32 133.25,52.57 LED18.3-GND | 133.25,53.32 138.25,58.32 138.25,62.57 | 138.25,62.57 158.5,62.57 | 158.5,62.57 158.5,37.32 | LED19.3-GND 51,85.57 51,87.07 52.75,88.82 C19.2 53,89.07 53,89.32 53.5,89.82 59.75,89.82 | LED20.3-GND 68.75,85.57 68.75,87.07 70.5,88.82 C20.2 70.5,89.07 70.5,89.82 59.75,89.82 | U2.J3_22 3.75,116.07 3.75,113.57 U2.J3_21 3.75,113.32 1.5,111.07 1.5,65.07 3.75,62.82 U2.J3_1 | 59.75,89.82 59.75,120.57 U$22.1 | C2.2 40,32.82 38.25,31.07 38.25,29.82 LED2.3-GND 38.25,29.57 42,25.82 42,18.82 43,17.82 U$2.SW2 | v43.25,30.57 43.25,45.82 U1.12 | 16.75,31.07 18,32.32 18,32.57 18.25,32.82 C1.2 | 16.75,31.07 15.5,31.07 LED1.3-GND | 16.75,31.07 18.5,29.32 18.5,26.82 | 18.5,26.82 18.5,19.57 20.25,17.82 U$1.SW2 | 18.5,26.82 6.5,26.82 6.5,34.32 C21.- | C5.2 111,32.82 109.5,31.32 109.5,29.82 LED5.3-GND 109.5,29.57 111.75,27.32 111.75,17.82 U$5.SW2 | C3.2 62.75,32.82 61.25,31.32 61.25,29.82 LED3.3-GND 61.25,29.57 64.75,26.07 64.75,19.07 U$3.SW2 | U$4.SW2 88.75,17.82 88.75,26.07 85.25,29.57 LED4.3-GND 85.25,29.82 85.25,31.07 87,32.82 C4.2 85.5,34.57 85.5,47.32 | C13.2 97,82.32 96.5,81.82 96.5,72.57 94,70.07 U$14.SW2 94,69.82 94,60.32 88.75,55.07 88.75,53.32 | 88.75,53.32 85.75,53.32 C16.2 85.5,53.32 85.5,47.32 | 88.75,53.32 88.75,52.57 LED16.3-GND | 85.5,47.32 50.75,47.32 U1.15
  Bottom 0.305: U$10.SW2 194.25,50.82 171.5,50.82 U$9.SW2 | U$13.SW2 138.25,97.82 117,97.82 U$12.SW2 116.75,97.82 94,97.82 U$11.SW2 | U$19.D 142,110.07 141,111.07 120.75,111.07 119.75,110.07 117,110.07 U$18.D | U$22.1 59.5,120.57 46.25,120.57 42,116.32 U2.J1_22 41.75,116.07 4,116.07 U2.J3_22 | 43.25,17.82 v43.25,30.57 | U2.J3_1 4,62.57 4,34.57 6.25,34.57 C21.- | U$1.SW2 20.5,17.82 43,17.82 U$2.SW2 43.25,17.82 | U$8.SW2 180.25,17.82 157.5,17.82 U$7.SW2 157.25,17.82 134.75,17.82 U$6.SW2 134.5,17.82 112,17.82 U$5.SW2 111.75,17.82 89,17.82 U$4.SW2 88.75,17.82 66.25,17.82 U$3.SW2 66,17.82 43.25,17.82 | U$15.SW2 116.75,69.82 94,69.82 U$14.SW2
  pour Bottom (isolate 0.5): 0,130.81 205.74,130.81 205.74,0 0,0
  pour Top (isolate 0.5): 0,130.81 0,0 205.74,0 205.74,130.81
N$3
  Top 0.305: LED1.2-DOUT 20.25,30.82 37,30.82 37,27.32 38,26.32 LED2.4-DIN
N$7  (via drill 0.3)
  Top 0.305: v44.5,29.57 43.25,29.57 LED2.2-DOUT | v60,27.32 61,26.32 LED3.4-DIN
  Bottom 0.305: v44.5,29.57 46.75,27.32 v60,27.32
N$11
  Top 0.305: LED3.2-DOUT 66,29.57 84,29.57 84,27.32 85,26.32 LED4.4-DIN
N$16
  Top 0.305: LED4.2-DOUT 90.25,29.82 98.5,38.07 108.25,38.07 108.25,27.32 109.25,26.32 LED5.4-DIN
N$19
  Top 0.305: LED5.2-DOUT 114.25,29.57 128.5,29.57 128.5,27.32 129.5,26.32 LED6.4-DIN
N$23
  Top 0.305: LED6.2-DOUT 134.75,29.57 151.25,29.57 151.25,27.32 152.25,26.32 LED7.4-DIN
N$27
  Top 0.305: LED7.2-DOUT 157.5,29.57 174.25,29.57 174.25,27.32 175.25,26.32 LED8.4-DIN
N$32  (via drill 0.3)
  Top 0.305: v179.25,30.82 180.25,29.82 LED8.2-DOUT | v163.5,44.32 161.5,46.32 161.5,59.07 LED9.4-DIN
  Bottom 0.305: v179.25,30.82 165.75,44.32 v163.5,44.32
N$35
  Top 0.305: LED10.4-DIN 171.5,59.32 167.5,63.32 166.5,63.32 166.5,62.82 LED9.2-DOUT
N$39
  Top 0.305: LED10.2-DOUT 176.5,62.57 183,62.57 183,60.32 184,59.32 LED11.4-DIN
N$43
  Top 0.305: LED12.4-DIN 194.25,59.32 190.25,63.32 189.25,63.32 189.25,62.82 LED11.2-DOUT
N$48  (via drill 0.3)
  Top 0.305: v195.75,62.82 199.25,62.82 LED12.2-DOUT | v91.75,74.32 89,77.07 LED13.4-DIN
  Bottom 0.305: v195.75,62.82 184.25,74.32 v91.75,74.32
N$51  (via drill 0.3)
  Top 0.305: v95.25,80.32 94,80.32 LED13.2-DOUT | v110.25,78.82 111.75,77.32 LED14.4-DIN
  Bottom 0.305: v95.25,80.32 96.75,78.82 v110.25,78.82
N$55
  Top 0.305: LED14.2-DOUT 116.75,80.57 118.75,82.57 118.75,83.32 119.25,83.82 132.25,83.82 132.25,78.32 133.25,77.32 LED15.4-DIN
N$59  (via drill 0.3)
  Top 0.305: v99.75,70.57 99.75,65.32 92.25,57.82 92.25,52.57 89,49.32 LED16.4-DIN | v135.75,73.57 137.25,75.07 137.25,79.32 138.25,80.32 LED15.2-DOUT
  Bottom 0.305: v99.75,70.57 102.75,73.57 v135.75,73.57
N$64
  Top 0.305: LED16.2-DOUT 94,52.32 103.5,52.32 103.5,52.07 106.25,49.32 111.75,49.32 LED17.4-DIN
N$67  (via drill 0.3)
  Top 0.305: v119,50.07 116.75,52.32 LED17.2-DOUT | v132.5,50.07 133.25,49.32 LED18.4-DIN
  Bottom 0.305: v132.5,50.07 v119,50.07
N$71  (via drill 0.3)
  Top 0.305: v51.25,75.82 51.25,81.82 51,82.07 LED19.4-DIN | v137.5,53.32 138.25,52.57 LED18.2-DOUT
  Bottom 0.305: v51.25,75.82 73.75,53.32 v137.5,53.32
N$75
  Top 0.305: LED19.2-DOUT 56,85.32 67.5,85.32 67.5,83.32 68.5,82.32 LED20.4-DIN
S0  (via drill 0.3)
  Top 0.305: v42.25,47.82 42.25,47.32 43.25,47.32 U1.10 | v11.5,78.57 6.25,83.82 6.25,90.82 4,93.07 U2.J3_13
  Bottom 0.305: v11.5,78.57 v42.25,47.82
S1  (via drill 0.3)
  Top 0.305: v42.25,46.57 43.25,46.57 U1.11 | v10.25,78.57 5.75,83.07 5.75,88.82 4,90.57 U2.J3_12
  Bottom 0.305: v10.25,78.57 v42.25,46.57
S2  (via drill 0.3)
  Top 0.305: v48.5,46.82 48.5,46.57 50.5,46.57 U1.14
  Bottom 0.305: v48.5,46.82 16,79.32 3.25,79.32 2.5,80.07 2.5,88.07 3.75,88.07 U2.J3_11
S3
  Top 0.305: U1.13 50.5,46.07 47.75,46.07 47.75,52.82 23.5,77.07 5.25,77.07 5.25,84.32 4,85.57 U2.J3_10
SCL
  Bottom 0.305: U2.J3_6 3.75,75.57 2,77.32 2,114.82 56.75,114.82 62,120.07 62,120.57 U$22.2
SDA
  Top 0.305: U2.J3_7 3.75,78.07 2.5,79.32 2.5,96.32 3.25,97.07 9.25,97.07 36.5,124.32 64.75,124.32 64.75,120.82 U$22.3
SWE1  (via drill 0.3)
  Top 0.305: U$17.E 87.75,109.82 87.75,103.32 88,103.07 R17.2 88,102.82 88,102.57 v84.25,98.82
  Bottom 0.305: v84.25,98.82 45,98.82 42,95.82 U2.J1_14
SWE2
  Top 0.305: R18.2 112.25,103.07 112,103.32 112,109.82 U$18.E
  Bottom 0.305: U2.J3_17 12.75,112.32 57.75,112.32 59,111.07 110.75,111.07 111.75,110.07 U$18.E
SWE3
  Top 0.305: R19.2 137.5,103.07 137.25,103.32 137.25,109.82 U$19.E
  Bottom 0.305: U2.J3_16 4,101.07 5,102.07 129.25,102.07 137,109.82 U$19.E
SWE4
  Top 0.305: R20.2 159.25,103.07 159,103.32 159,109.82 U$20.E
  Bottom 0.305: U2.J3_9 4,83.07 20.5,99.57 42.5,99.57 44.5,101.57 150.5,101.57 158.75,109.82 U$20.E
SWE5
  Top 0.305: R21.2 178.25,70.07 178,70.32 178,75.32 U$21.E
  Bottom 0.305: U2.J3_8 4,80.57 5.25,81.82 169.5,81.82 175.75,75.57 177.75,75.57 U$21.E